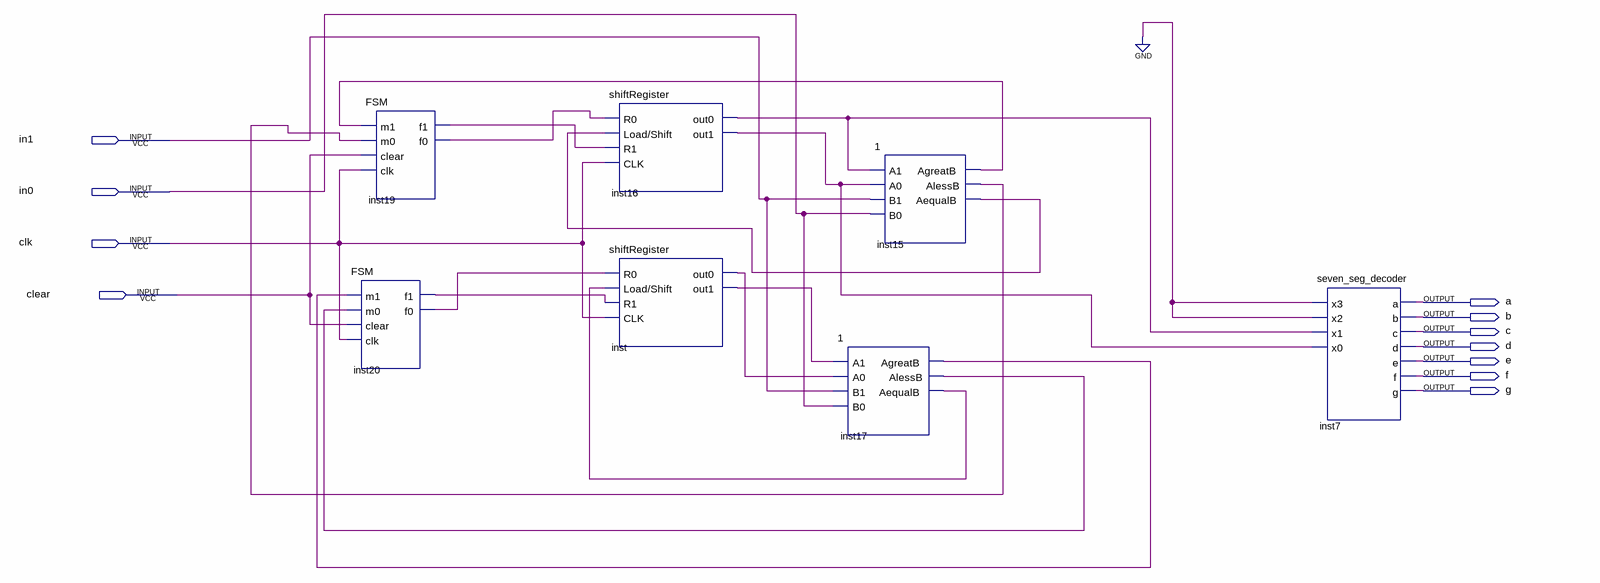
[diagram p0: schematic sheet]
// Quartus schematic FinalBuild.bdf as structural Verilog: 7 symbols, 11 pins
module FinalBuild (
  input  in1,
  input  in0,
  input  clk,
  input  clear,
  output a,
  output b,
  output c,
  output d,
  output e,
  output f,
  output g
);

  wire inst15_aequalb, inst15_agreatb, inst15_alessb, inst16_out0, inst16_out1, inst17_aequalb,
       inst17_agreatb, inst17_alessb, inst19_f0, inst19_f1, inst20_f0, inst20_f1, inst_out0, inst_out1;

  FSM inst19 (.m1(inst15_agreatb), .m0(inst15_alessb), .clear(clear), .clk(clk), .f1(inst19_f1), .f0(inst19_f0));
  FSM inst20 (.m1(inst17_agreatb), .m0(inst17_alessb), .clear(clear), .clk(clk), .f1(inst20_f1), .f0(inst20_f0));
  shiftRegister inst16 (
    .R0(inst19_f0), .\Load/Shift (inst15_aequalb), .R1(inst19_f1), .CLK(clk), .out0(inst16_out0),
    .out1(inst16_out1));
  shiftRegister inst (
    .R0(inst20_f0), .\Load/Shift (inst17_aequalb), .R1(inst20_f1), .CLK(clk), .out0(inst_out0),
    .out1(inst_out1));
  \1  inst17 (
    .A1(inst_out1), .A0(inst_out0), .B1(in1), .B0(in0), .AgreatB(inst17_agreatb), .AlessB(inst17_alessb),
    .AequalB(inst17_aequalb));
  \1  inst15 (
    .A1(inst16_out0), .A0(inst16_out1), .B1(in1), .B0(in0), .AgreatB(inst15_agreatb), .AlessB(inst15_alessb),
    .AequalB(inst15_aequalb));
  seven_seg_decoder inst7 (
    .x3(1'b0), .x2(1'b0), .x1(inst16_out0), .x0(inst16_out1), .a(a), .b(b), .c(c), .d(d), .e(e), .f(f), .g(g));
endmodule
